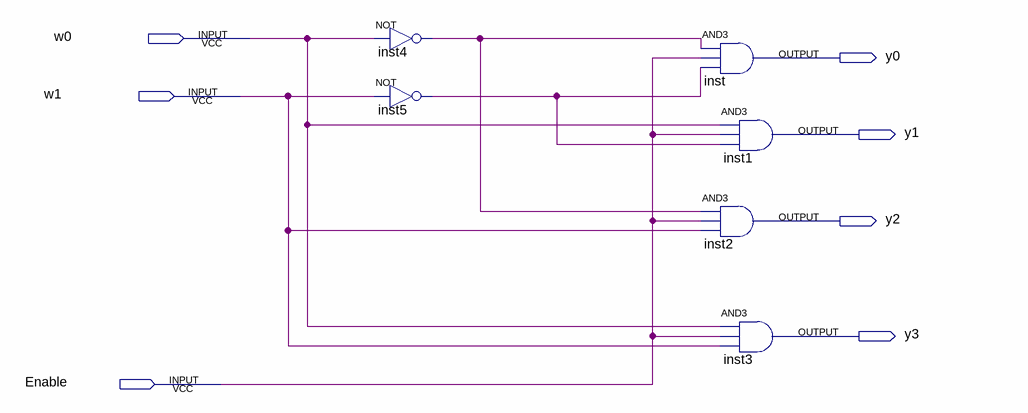
[diagram p0: schematic sheet]
// Quartus schematic 2to4decoder.bdf as structural Verilog: 6 symbols, 7 pins
module \2to4decoder  (
  input  w0,
  input  w1,
  input  Enable,
  output y0,
  output y1,
  output y2,
  output y3
);

  wire inst4_out, inst5_out;

  not inst4 (inst4_out, w0);
  not inst5 (inst5_out, w1);
  and inst (y0, inst4_out, Enable, inst5_out);
  and inst1 (y1, w0, Enable, inst5_out);
  and inst2 (y2, inst4_out, Enable, w1);
  and inst3 (y3, w0, Enable, w1);
endmodule
